# EAGLE schematic kapacz_drecyciel (EAGLE 6.6.0)
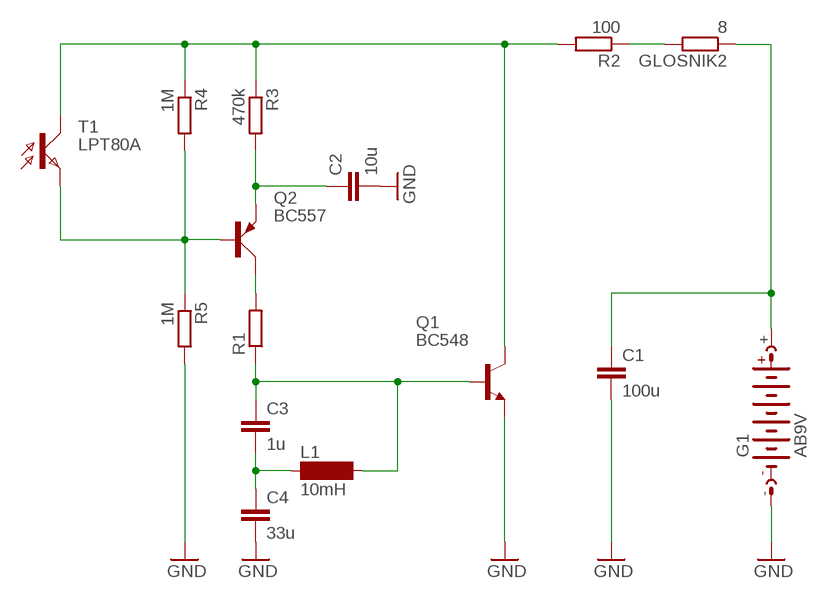
[diagram p0: schematic, sheet 1]

## Parts
C1  100u  C2,5-3  [C2.5-3]
C2  10u  C2,5-3  [C2.5-3]
C3  1u  C2,5-3  [C2.5-3]
C4  33u  C2,5-3  [C2.5-3]
G1  AB9V  [AB9V]
GLOSNIK2  8  R-EU_M0805  [M0805]
L1  10mH  BS11  [BS11]
Q1  BC548  [TO92-EBC]
Q2  BC557  [SOT54A]
R1  R-EU_0204/7  [0204/7]
R2  100  R-EU_M0805  [M0805]
R3  470k  R-EU_M0805  [M0805]
R4  1M  R-EU_M0805  [M0805]
R5  1M  R-EU_M0805  [M0805]
T1  LPT80A  [LPT80A]

## Nets
GND: C1.2 C2.2 C4.2 G1.- Q1.E R5.2
N$2: C1.1 G1.+ GLOSNIK2.1
N$3: Q2.C R1.2
N$4: C3.1 L1.2 Q1.B R1.1
N$5: C3.2 C4.1 L1.1
N$7: C2.1 Q2.E R3.2
N$8: GLOSNIK2.2 R2.1
N$9: Q2.B R4.2 R5.1 T1.E
N$10: Q1.C R2.2 R3.1 R4.1 T1.C

## Library data of the parts
C1-C4 = capacitor-wima:C: CAPACITOR naming: grid - package width
G1 = battery:AB9V: 9-V BATTERY CLIP
GLOSNIK2 R2-R5 = resistor:R-EU_: RESISTOR, European symbol
L1 = inductor-neosid:BS: INDUCTOR nominal inductance, magnetically screened; OC_FARNELL: unknown; OC_NEWARK: unknown
Q1 = transistor-npn:BC548*: NPN Transistor
Q2 = transistor-small-signal:BC557: PNP TRANSISTOR
R1 = rcl:R-EU_: RESISTOR, European symbol
T1 = opto-trans-siemens:LPT80A: PHOTO TRANSISTOR; OC_FARNELL: unknown; OC_NEWARK: unknown